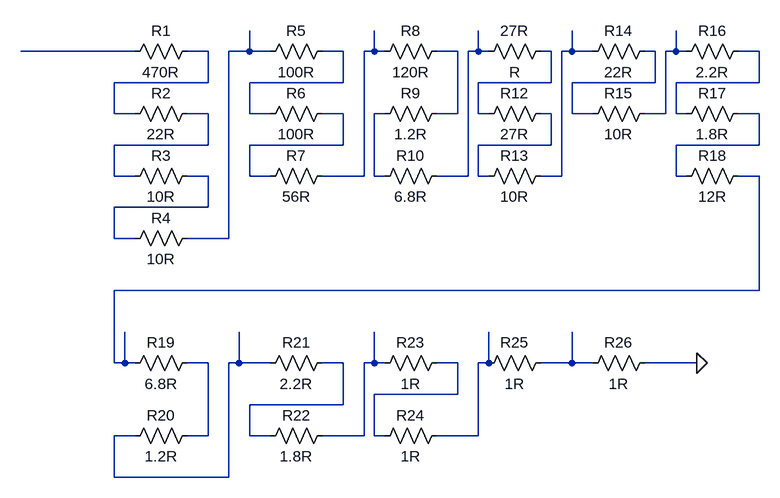
[diagram p0: schematic voltage_divider.asc]
voltage_divider.asc, the LTspice schematic file:
Version 4
SHEET 1 880 680
WIRE -880 -304 -1056 -304
WIRE -768 -304 -800 -304
WIRE -704 -304 -704 -336
WIRE -704 -304 -736 -304
WIRE -672 -304 -704 -304
WIRE -560 -304 -592 -304
WIRE -512 -304 -512 -336
WIRE -512 -304 -528 -304
WIRE -496 -304 -512 -304
WIRE -384 -304 -416 -304
WIRE -352 -304 -352 -336
WIRE -352 -304 -368 -304
WIRE -336 -304 -352 -304
WIRE -240 -304 -256 -304
WIRE -208 -304 -208 -336
WIRE -208 -304 -224 -304
WIRE -176 -304 -208 -304
WIRE -80 -304 -96 -304
WIRE -48 -304 -48 -336
WIRE -48 -304 -64 -304
WIRE -32 -304 -48 -304
WIRE 80 -304 48 -304
WIRE -768 -256 -768 -304
WIRE -768 -256 -912 -256
WIRE -560 -256 -560 -304
WIRE -560 -256 -704 -256
WIRE -240 -256 -240 -304
WIRE -240 -256 -352 -256
WIRE -80 -256 -80 -304
WIRE -80 -256 -208 -256
WIRE 80 -256 80 -304
WIRE 80 -256 -48 -256
WIRE -912 -208 -912 -256
WIRE -880 -208 -912 -208
WIRE -768 -208 -800 -208
WIRE -704 -208 -704 -256
WIRE -672 -208 -704 -208
WIRE -560 -208 -592 -208
WIRE -496 -208 -512 -208
WIRE -384 -208 -384 -304
WIRE -384 -208 -416 -208
WIRE -352 -208 -352 -256
WIRE -336 -208 -352 -208
WIRE -240 -208 -256 -208
WIRE -208 -208 -208 -256
WIRE -176 -208 -208 -208
WIRE -64 -208 -64 -304
WIRE -64 -208 -96 -208
WIRE -48 -208 -48 -256
WIRE -32 -208 -48 -208
WIRE 80 -208 48 -208
WIRE -768 -160 -768 -208
WIRE -768 -160 -912 -160
WIRE -560 -160 -560 -208
WIRE -560 -160 -704 -160
WIRE -240 -160 -240 -208
WIRE -240 -160 -352 -160
WIRE 80 -160 80 -208
WIRE 80 -160 -48 -160
WIRE -912 -112 -912 -160
WIRE -880 -112 -912 -112
WIRE -768 -112 -800 -112
WIRE -704 -112 -704 -160
WIRE -672 -112 -704 -112
WIRE -528 -112 -528 -304
WIRE -528 -112 -592 -112
WIRE -512 -112 -512 -208
WIRE -496 -112 -512 -112
WIRE -368 -112 -368 -304
WIRE -368 -112 -416 -112
WIRE -352 -112 -352 -160
WIRE -336 -112 -352 -112
WIRE -224 -112 -224 -304
WIRE -224 -112 -256 -112
WIRE -48 -112 -48 -160
WIRE -32 -112 -48 -112
WIRE 80 -112 48 -112
WIRE -768 -64 -768 -112
WIRE -768 -64 -912 -64
WIRE -912 -16 -912 -64
WIRE -880 -16 -912 -16
WIRE -736 -16 -736 -304
WIRE -736 -16 -800 -16
WIRE 80 64 80 -112
WIRE 80 64 -912 64
WIRE -912 176 -912 64
WIRE -896 176 -896 128
WIRE -896 176 -912 176
WIRE -880 176 -896 176
WIRE -768 176 -800 176
WIRE -720 176 -720 128
WIRE -720 176 -736 176
WIRE -672 176 -720 176
WIRE -560 176 -592 176
WIRE -512 176 -512 128
WIRE -512 176 -528 176
WIRE -496 176 -512 176
WIRE -384 176 -416 176
WIRE -336 176 -336 128
WIRE -336 176 -352 176
WIRE -208 176 -208 128
WIRE -208 176 -256 176
WIRE -176 176 -208 176
WIRE -16 176 -96 176
WIRE -384 224 -384 176
WIRE -384 224 -512 224
WIRE -560 240 -560 176
WIRE -560 240 -704 240
WIRE -880 288 -912 288
WIRE -768 288 -768 176
WIRE -768 288 -800 288
WIRE -704 288 -704 240
WIRE -672 288 -704 288
WIRE -528 288 -528 176
WIRE -528 288 -592 288
WIRE -512 288 -512 224
WIRE -496 288 -512 288
WIRE -352 288 -352 176
WIRE -352 288 -416 288
WIRE -912 352 -912 288
WIRE -736 352 -736 176
WIRE -736 352 -912 352
FLAG -16 176 0
SYMBOL res -896 -288 R270
WINDOW 0 32 56 VTop 2
WINDOW 3 0 56 VBottom 2
SYMATTR InstName R1
SYMATTR Value 470R
SYMBOL res -896 -192 R270
WINDOW 0 32 56 VTop 2
WINDOW 3 0 56 VBottom 2
SYMATTR InstName R2
SYMATTR Value 22R
SYMBOL res -896 -96 R270
WINDOW 0 32 56 VTop 2
WINDOW 3 0 56 VBottom 2
SYMATTR InstName R3
SYMATTR Value 10R
SYMBOL res -896 0 R270
WINDOW 0 32 56 VTop 2
WINDOW 3 0 56 VBottom 2
SYMATTR InstName R4
SYMATTR Value 10R
SYMBOL res -688 -288 R270
WINDOW 0 32 56 VTop 2
WINDOW 3 0 56 VBottom 2
SYMATTR InstName R5
SYMATTR Value 100R
SYMBOL res -688 -192 R270
WINDOW 0 32 56 VTop 2
WINDOW 3 0 56 VBottom 2
SYMATTR InstName R6
SYMATTR Value 100R
SYMBOL res -688 -96 R270
WINDOW 0 32 56 VTop 2
WINDOW 3 0 56 VBottom 2
SYMATTR InstName R7
SYMATTR Value 56R
SYMBOL res -400 -320 R90
WINDOW 0 0 56 VBottom 2
WINDOW 3 32 56 VTop 2
SYMATTR InstName R8
SYMATTR Value 120R
SYMBOL res -400 -224 R90
WINDOW 0 0 56 VBottom 2
WINDOW 3 32 56 VTop 2
SYMATTR InstName R9
SYMATTR Value 1.2R
SYMBOL res -400 -128 R90
WINDOW 0 0 56 VBottom 2
WINDOW 3 32 56 VTop 2
SYMATTR InstName R10
SYMATTR Value 6.8R
SYMBOL res -240 -320 R90
WINDOW 0 0 56 VBottom 2
WINDOW 3 32 56 VTop 2
SYMATTR InstName 27R
SYMBOL res -240 -224 R90
WINDOW 0 0 56 VBottom 2
WINDOW 3 32 56 VTop 2
SYMATTR InstName R12
SYMATTR Value 27R
SYMBOL res -240 -128 R90
WINDOW 0 0 56 VBottom 2
WINDOW 3 32 56 VTop 2
SYMATTR InstName R13
SYMATTR Value 10R
SYMBOL res -80 -320 R90
WINDOW 0 0 56 VBottom 2
WINDOW 3 32 56 VTop 2
SYMATTR InstName R14
SYMATTR Value 22R
SYMBOL res -80 -224 R90
WINDOW 0 0 56 VBottom 2
WINDOW 3 32 56 VTop 2
SYMATTR InstName R15
SYMATTR Value 10R
SYMBOL res 64 -320 R90
WINDOW 0 0 56 VBottom 2
WINDOW 3 32 56 VTop 2
SYMATTR InstName R16
SYMATTR Value 2.2R
SYMBOL res 64 -224 R90
WINDOW 0 0 56 VBottom 2
WINDOW 3 32 56 VTop 2
SYMATTR InstName R17
SYMATTR Value 1.8R
SYMBOL res 64 -128 R90
WINDOW 0 0 56 VBottom 2
WINDOW 3 32 56 VTop 2
SYMATTR InstName R18
SYMATTR Value 12R
SYMBOL res -784 160 R90
WINDOW 0 0 56 VBottom 2
WINDOW 3 32 56 VTop 2
SYMATTR InstName R19
SYMATTR Value 6.8R
SYMBOL res -784 272 R90
WINDOW 0 0 56 VBottom 2
WINDOW 3 32 56 VTop 2
SYMATTR InstName R20
SYMATTR Value 1.2R
SYMBOL res -576 160 R90
WINDOW 0 0 56 VBottom 2
WINDOW 3 32 56 VTop 2
SYMATTR InstName R21
SYMATTR Value 2.2R
SYMBOL res -576 272 R90
WINDOW 0 0 56 VBottom 2
WINDOW 3 32 56 VTop 2
SYMATTR InstName R22
SYMATTR Value 1.8R
SYMBOL res -400 160 R90
WINDOW 0 0 56 VBottom 2
WINDOW 3 32 56 VTop 2
SYMATTR InstName R23
SYMATTR Value 1R
SYMBOL res -400 272 R90
WINDOW 0 0 56 VBottom 2
WINDOW 3 32 56 VTop 2
SYMATTR InstName R24
SYMATTR Value 1R
SYMBOL res -240 160 R90
WINDOW 0 0 56 VBottom 2
WINDOW 3 32 56 VTop 2
SYMATTR InstName R25
SYMATTR Value 1R
SYMBOL res -80 160 R90
WINDOW 0 0 56 VBottom 2
WINDOW 3 32 56 VTop 2
SYMATTR InstName R26
SYMATTR Value 1R

The netlist it stands for:
* voltage_divider.asc
R1 N001 N002 470R
R2 N002 N013 22R
R3 N013 N018 10R
R4 N018 N003 10R
R5 N003 N004 100R
R6 N004 N014 100R
R7 N014 N005 56R
R8 N006 N005 120R
R9 N006 N015 1.2R
R10 N007 N015 6.8R
R§27R N008 N007 R
R12 N016 N008 27R
R13 N009 N016 10R
R14 N010 N009 22R
R15 N011 N010 10R
R16 N012 N011 2.2R
R17 N017 N012 1.8R
R18 N019 N017 12R
R19 N020 N019 6.8R
R20 N020 N021 1.2R
R21 N022 N021 2.2R
R22 N023 N022 1.8R
R23 N024 N023 1R
R24 N025 N024 1R
R25 N026 N025 1R
R26 0 N026 1R
.backanno
.end